# EAGLE design USB_POWERED_v1 (EAGLE 8.2.1)
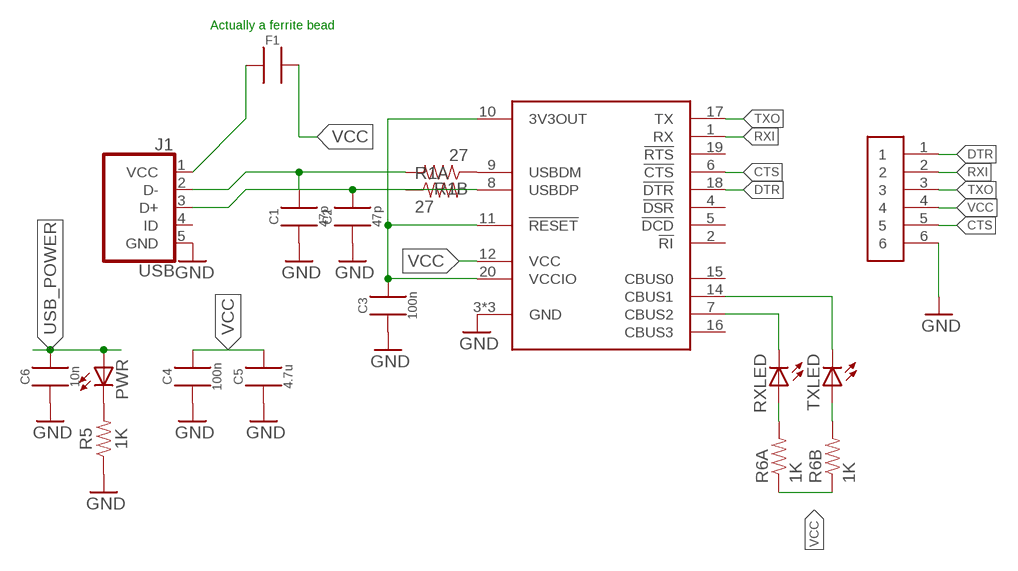
[diagram p0: schematic, sheet 1]

## Parts
C1  47p  CAP0603A  [0603_A]
C2  47p  CAP0603A  [0603_A]
C3  100n  CAP0603A  [0603_A]
C4  100n  CAP0603A  [0603_A]
C5  4.7u  CAP0603A  [0603_A]
C6  10n  CAP0603A  [0603_A]
F1  CAP0603A  [0603_A]
J1  USB  [629105136821]
PWR  LEDCHIP-LED0805  [CHIP-LED0805]
R1  27  RESISTOR_ARRAY_2  [RESISTOR_ARRAY_CTS_742C043]
R5  1K  RESISTOR0603  [0603]
R6  1K  RESISTOR_ARRAY_2  [RESISTOR_ARRAY_CTS_742C043]
RXLED  LEDCHIP-LED0805  [CHIP-LED0805]
TXLED  LEDCHIP-LED0805  [CHIP-LED0805]
U$1  FT231XQFN  [QFN-20]
U$2  M06  [M20_6_PIN]

## Nets
3V3OUT: C3.2 U$1.10(3V3OUT) U$1.11(!RESET) U$1.20(VCCIO)
CTS: U$1.6(!CTS) U$2.5
DTR: U$1.18(!DTR) U$2.1
GND: C1.1 C2.1 C3.1 C4.1 C5.1 C6.1 J1.5(GND) R5.1 U$1.3(GND) U$1.13(GND) U$1.21(GND) U$2.6
N$1: R1.P$5 U$1.9(USBDM)
N$2: R1.P$3 U$1.8(USBDP)
N$3: PWR.C R5.2
N$4: C1.2 J1.2(D-) R1.P$6
N$5: C2.2 J1.3(D+) R1.P$4
N$6: R6.P$6 TXLED.A
N$7: R6.P$4 RXLED.A
N$8: RXLED.C U$1.7(CBUS2)
N$9: TXLED.C U$1.14(CBUS1)
RXI: U$1.1(RX) U$2.2
TXO: U$1.17(TX) U$2.3
USB_POWER: C6.2 F1.1 J1.1(VCC) PWR.A
VCC: C4.2 C5.2 F1.2 R6.P$3 R6.P$5 U$1.12(VCC) U$2.4
Unconnected: J1.4(ID) U$1.2(!RI) U$1.4(!DSR) U$1.5(!DCD) U$1.15(CBUS0) U$1.16(CBUS3) U$1.19(!RTS)

## Notes on the sheet
- Actually a ferrite bead

## Library data of the parts
C1-C6 F1 = KEMET:CAP
J1 = Wurth:USB
PWR RXLED TXLED = led:LED: LED OSRAM: - CHIPLED LG R971, LG N971, LY N971, LG Q971, LY Q971, LO R971, LY R971 LH N974, LH R974 LS Q976, LO Q976, LY Q976 LO Q996 - Hyper CHIPLED LW Q18S LB Q993, LB Q99A, LB R99A - SideLED LS A670, LO A670, LY A670, LG A670, LP A670 LB A673, LV A673, LT A673, LW A673 LH A674 LY A675 LS A676, LA A676, LO A676, LY A676, LW A676 LS A679, LY A679, LG A679 - Hyper Micro SIDELED® LS Y876, LA Y876, LO Y876, LY Y876 LT Y87S - SmartLED LW L88C, LW L88S LB L89C, LB L89S, LG L890 LS L89K, LO L89K, LY L89K LS L896, LA L896, LO L896, LY L896 - TOPLED LS T670, LO T670, LY T670, LG T670, LP T670 LSG T670, LSP T670, LSY T670, LOP T670, LYG T670 LG T671, LOG T671, LSG T671 LB T673, LV T673, LT T673, LW T673 LH T674 LS T676, LA T676, LO T676, LY T676, LB T676, LH T676, LSB T676, LW T676 LB T67C, LV T67C, LT T67C, LS T67K, LO T67K, LY T67K, LW E67C LS E67B, LA E67B, LO E67B, LY E67B, LB E67C, LV E67C, LT E67C LW T67C LS T679, LY T679, LG T679 LS T770, LO T770, LY T770, LG T770, LP T770 LB T773, LV T773, LT T773, LW T773 LH T774 LS E675, LA E675, LY E675, LS T675 LS T776, LA T776, LO T776, LY T776, LB T776 LHGB T686 LT T68C, LB T68C - Hyper Mini TOPLED® LB M676 - Mini TOPLED Santana® LG M470 LS M47K, LO M47K, LY M47K Source: http://www.osram.convergy.de LUXEON: - LUMILED® LXK2-PW12-R00, LXK2-PW12-S00, LXK2-PW14-U00, LXK2-PW14-V00 LXK2-PM12-R00, LXK2-PM12-S00, LXK2-PM14-U00 LXK2-PE12-Q00, LXK2-PE12-R00, LXK2-PE12-S00, LXK2-PE14-T00, LXK2-PE14-U00 LXK2-PB12-K00, LXK2-PB12-L00, LXK2-PB12-M00, LXK2-PB14-N00, LXK2-PB14-P00, LXK2-PB14-Q00 LXK2-PR12-L00, LXK2-PR12-M00, LXK2-PR14-Q00, LXK2-PR14-R00 LXK2-PD12-Q00, LXK2-PD12-R00, LXK2-PD12-S00 LXK2-PH12-R00, LXK2-PH12-S00 LXK2-PL12-P00, LXK2-PL12-Q00, LXK2-PL12-R00 Source: www.luxeon.com KINGBRIGHT: KA-3528ASYC Source: www.kingbright.com
R1 R6 = ERIC:RESISTOR_ARRAY_2
R5 = Stackpole:RESISTOR
U$1 = FTDI:FT231X
U$2 = HARWIN:M06

## Board
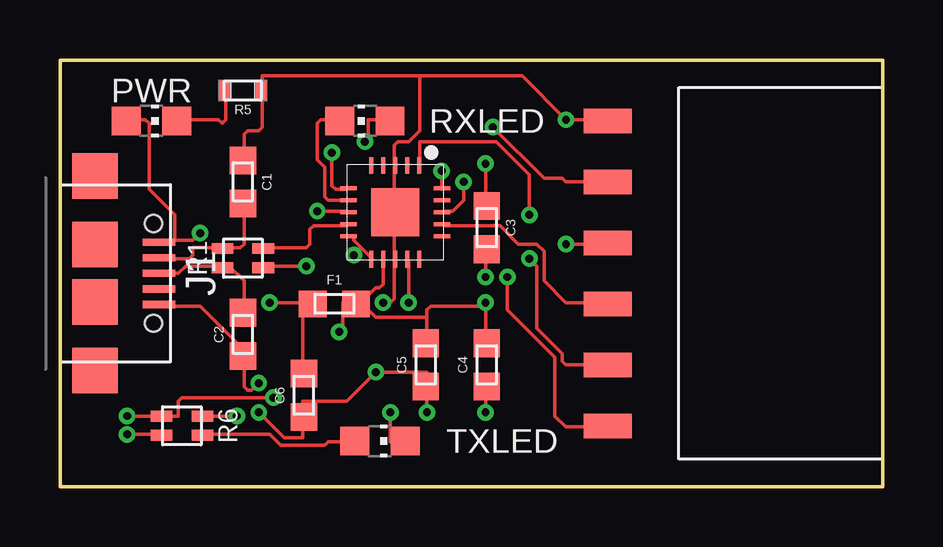
[diagram p1: board, top side]
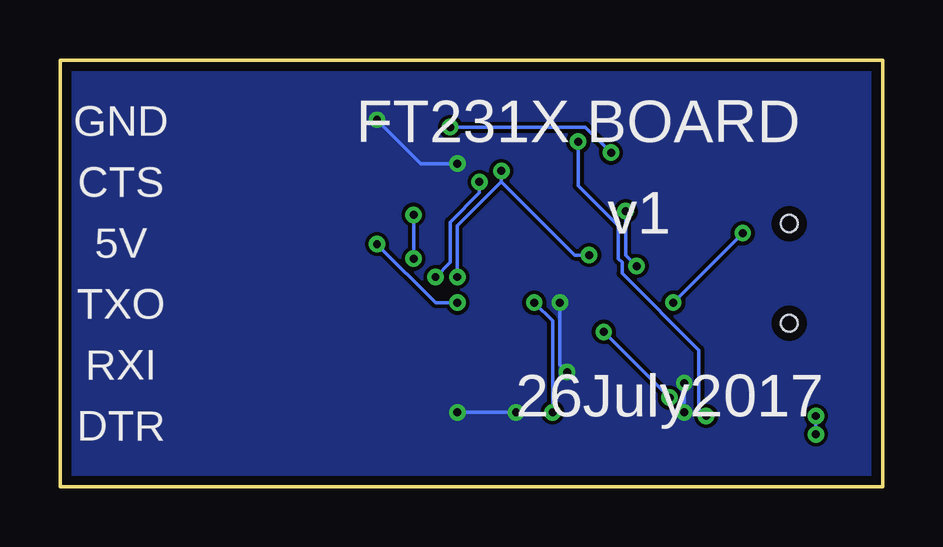
[diagram p2: board, bottom side, seen from below]

Size 34.29 x 17.78 mm. Coordinates in mm from the lower left corner, seen from the top.
Outline: 0,17.78 34.29,17.78 34.29,0 0,0 0,17.78
Copper layers (1*16): Top 0.0356mm / dielectric 1.5011mm / Bottom 0.0356mm
Design rules "oshpark-2layer-2": minimum track width 6mil, minimum drill 13mil, track to track 6mil, track to pad 6mil, pad to pad 6mil, via to via 6mil, smd to smd 6mil, copper to edge 15mil, drill to drill 6mil, minimum pad ring 7mil, minimum via ring 7mil, stop-mask expansion 2.5mil, vias tented up to drill 0mil, thermal gap 10mil

### Footprints (pad centres in the part's own frame; a part is rotated, then mirrored left to right if it is on the bottom)
0603_A = smd 1.15 x 1.1: 1 -0.9,0; 2 0.9,0
629105136821 = smd 0.3 x 1.35: 1 -1.3,4.125; 2 -0.65,4.125; 3 0,4.125; 4 0.65,4.125; 5 1.3,4.125 | smd 1.9 x 1.9: P$6 1.2,1.45; P$7 -1.2,1.45; P$8 4.05,1.45; P$9 -4.05,1.45 | hole 0.7: -2.075,3.9; 2.075,3.9
CHIP-LED0805 = smd 1.2 x 1.2: A 0,-1.05; C 0,1.05
RESISTOR_ARRAY_CTS_742C043 = smd 0.45 x 0.9: P$3 -0.4,-0.85; P$4 -0.4,0.85; P$5 0.4,-0.85; P$6 0.4,0.85
0603 = smd 0.5 x 0.9: 1 -0.75,0; 2 0.75,0
QFN-20 = smd 0.7 x 0.17: 1 -1.95,1; 2 -1.95,0.5; 3 -1.95,0; 4 -1.95,-0.5; 5 -1.95,-1; 11 1.95,-1; 12 1.95,-0.5; 13 1.95,0; 14 1.95,0.5; 15 1.95,1 | smd 0.17 x 0.7: 6 -1,-1.95; 7 -0.5,-1.95; 8 0,-1.95; 9 0.5,-1.95; 10 1,-1.95; 16 1,1.95; 17 0.5,1.95; 18 0,1.95; 19 -0.5,1.95; 20 -1,1.95 | smd 2 x 2: 21 0,0
M20_6_PIN = smd 1.02 x 2: 1 -6.35,11.475; 2 -3.81,11.475; 3 -1.27,11.475; 4 1.27,11.475; 5 3.81,11.475; 6 6.35,11.475

### Placement (x,y rotation side)
C1  7.62,12.7 270 top
C2  7.62,6.35 90 top
C3  17.78,10.79 270 top
C4  17.78,5.08 90 top
C5  15.24,5.08 90 top
C6  10.16,3.81 90 top
F1  11.43,7.62 0 top
J1  0,8.89 270 top
PWR  3.81,15.24 270 top
R1  7.62,9.53 90 top
R5  7.62,16.51 180 top
R6  5.08,2.54 270 top
RXLED  12.7,15.24 90 top
TXLED  13.33,1.91 270 top
U$1  13.97,11.43 270 top
U$2  34.29,8.89 90 top

### Tracks (layer width: path | path; a pad name or v marks a point on that pad's centre or on a via)
3V3OUT  (via drill 0.33)
  Top 0.152: 12.55,9.96 12.24,10.26 12.24,10.41 12.09,10.41 U$1.10 | 12.55,9.96 13,9.5 U$1.11 | v15.9,13.16 15.9,12.4 U$1.20 | v17.73,8.74 17.73,9.8 C3.2 | v12.24,9.65 12.55,9.96
  Bottom 0.152: 15.9,12.7 v15.9,13.16 | 15.9,12.7 17.73,10.87 v17.73,8.74 | v12.24,9.65 12.85,9.65 15.9,12.7
CTS  (via drill 0.33)
  Top 0.152: v11.33,13.92 11.33,12.55 11.48,12.4 11.94,12.4 U$1.6 | v18.03,14.99 20.17,12.85 20.93,12.85 21.08,12.7 U$2.5
  Bottom 0.152: v11.33,13.92 12.39,14.99 v18.03,14.99
DTR  (via drill 0.33)
  Top 0.152: v16.81,12.7 16.81,11.94 16.36,11.48 16.05,11.48 U$1.18 | v18.64,8.74 18.64,7.37 20.62,5.38 20.62,2.95 21.08,2.49 22.76,2.49 U$2.1
  Bottom 0.152: v16.81,12.7 16.81,12.24 18.03,11.02 18.03,9.35 v18.64,8.74
GND  (via drill 0.33)
  Top 0.152: 8.43,16.51 8.43,14.99 8.28,14.83 7.82,14.83 7.67,14.68 7.67,13.61 C1.1 | v17.73,13.46 17.73,11.79 C3.1 | U$2.6 22.76,15.29 v21.08,15.29 19.25,17.12 14.99,17.12 | 8.43,16.51 8.43,17.12 14.99,17.12 | 8.43,16.51 R5.1 | v8.28,3.1 9.35,2.03 10.11,2.03 10.11,2.79 C6.1 10.11,2.95 10.11,3.56 11.94,3.56 v13.16,4.78 15.29,4.78 15.29,4.32 C5.1 15.29,4.17 v15.29,3.1 | v8.28,4.32 7.98,4.01 7.82,4.01 7.67,4.17 7.67,5.38 C2.1 7.67,5.54 7.67,5.69 5.84,7.52 4.32,7.52 4.17,7.67 J1.5 | v17.73,3.1 17.73,4.17 C4.1 | 13.92,11.33 13.92,9.5 U$1.13 13.92,9.35 13.92,7.82 13.77,7.67 v13.46,7.67 | 13.92,11.33 13.77,11.48 13.92,11.63 13.92,13.31 U$1.3 13.92,13.46 13.92,14.22 14.07,14.38 14.53,14.38 14.99,14.83 14.99,17.12 | 13.92,11.33 U$1.21
  Bottom 0.152: v17.73,13.46 19.25,13.46 v21.08,15.29 | v8.28,4.32 v8.28,3.1 | v17.73,3.1 v15.29,3.1 | v13.16,4.78 13.46,5.08 v13.46,7.67
  pour Bottom: -2.54,26.67 41.91,26.67 41.91,-3.81 -2.54,-3.81
N$1
  Top 0.152: U$1.9 11.94,10.87 10.57,10.87 10.41,10.72 10.41,10.11 10.26,9.96 8.58,9.96 R1.P$5
N$2  (via drill 0.33)
  Top 0.152: v10.72,11.48 11.94,11.48 U$1.8 | v10.26,9.2 8.58,9.2 R1.P$3
  Bottom 0.152: v10.72,11.48 10.72,9.65 v10.26,9.2
N$3
  Top 0.152: R5.2 6.91,16.51 6.91,15.29 6.76,15.14 6.6,15.29 4.93,15.29 PWR.C
N$4
  Top 0.152: J1.2 4.17,9.5 5.38,9.5 5.54,9.65 5.54,9.96 6.76,9.96 R1.P$6 6.91,9.96 7.52,9.96 7.67,10.11 7.67,11.79 C1.2
N$5
  Top 0.152: J1.3 4.93,8.89 5.23,9.2 6.76,9.2 R1.P$4 6.91,9.2 7.06,9.2 7.67,8.59 7.67,7.37 C2.2
N$6
  Top 0.152: R6.P$6 5.99,2.18 8.74,2.18 9.2,1.73 11.02,1.73 11.18,1.88 12.24,1.88 TXLED.A
N$7  (via drill 0.33)
  Top 0.152: v7.37,2.95 5.99,2.95 R6.P$4 | v12.7,14.38 12.85,14.53 12.85,15.29 13.61,15.29 RXLED.A
  Bottom 0.152: v7.37,2.95 7.67,3.25 7.67,5.69 10.87,8.89 10.87,9.35 11.02,9.5 11.02,10.87 12.7,12.55 v12.7,14.38
N$8
  Top 0.152: U$1.7 11.94,11.94 11.18,11.94 11.02,12.09 11.02,13.31 10.72,13.61 10.72,15.14 10.87,15.29 11.63,15.29 RXLED.C
N$9  (via drill 0.33)
  Top 0.152: v14.53,7.67 14.53,9.35 U$1.14 | v13.77,3.1 13.77,1.88 14.38,1.88 TXLED.C
  Bottom 0.152: v14.53,7.67 13.77,6.91 v13.77,3.1
RXI  (via drill 0.33)
  Top 0.152: v19.56,11.33 19.56,13.01 18.19,14.38 14.99,14.38 14.99,13.46 U$1.1 | v19.56,9.5 19.86,9.2 19.86,6.6 20.93,5.54 20.93,5.23 21.08,5.08 U$2.2
  Bottom 0.152: v19.56,9.5 v19.56,11.33
TXO
  Top 0.152: U$1.17 16.05,10.87 18.34,10.87 19.1,10.11 19.86,10.11 20.17,9.8 20.17,8.59 21.08,7.67 22.76,7.67 U$2.3
USB_POWER  (via drill 0.33)
  Top 0.152: 10.11,7.67 10.11,4.78 C6.2 | 10.11,7.67 10.41,7.67 F1.1 10.11,7.67 | 4.77,10.26 4.77,11.33 3.71,12.4 3.71,15.14 3.56,15.29 2.79,15.29 PWR.A | 4.77,10.26 4.32,10.26 4.17,10.11 J1.1 4.77,10.26 | v8.74,7.67 10.11,7.67 | v5.84,10.57 5.54,10.26 4.77,10.26
  Bottom 0.152: v5.84,10.57 v8.74,7.67
VCC  (via drill 0.33)
  Top 0.152: 15.29,7.06 15.29,7.37 15.44,7.52 17.58,7.52 17.73,7.37 | 15.29,7.06 15.29,5.99 C5.2 | 17.73,7.37 17.73,5.99 C4.2 | v21.08,10.11 22.76,10.11 U$2.4 | 17.73,7.37 v17.73,7.67 | v2.79,2.18 4.17,2.18 R6.P$5 | v2.79,2.95 4.17,2.95 R6.P$3 4.32,2.95 4.93,2.95 4.93,3.56 5.08,3.71 v8.89,3.71 | 12.7,7.82 12.39,7.52 F1.2 | 12.7,7.82 13.16,8.28 13.31,8.28 13.46,8.43 13.46,9.35 U$1.12 | v11.63,6.45 11.79,6.6 11.79,7.67 12.24,7.67 F1.2 | 15.29,7.06 13.16,7.06 12.7,7.52 12.7,7.82 | 12.7,7.82 F1.2
  Bottom 0.152: v21.08,10.11 18.64,7.67 v17.73,7.67 | v2.79,2.95 v2.79,2.18 | v11.63,6.45 v8.89,3.71

### Text on the board
bPlace: FT231X BOARD | GND | CTS | v1 | 5V | TXO | RXI | 26July2017 | DTR